# EAGLE design FresiaBoard (EAGLE 7.7.0)
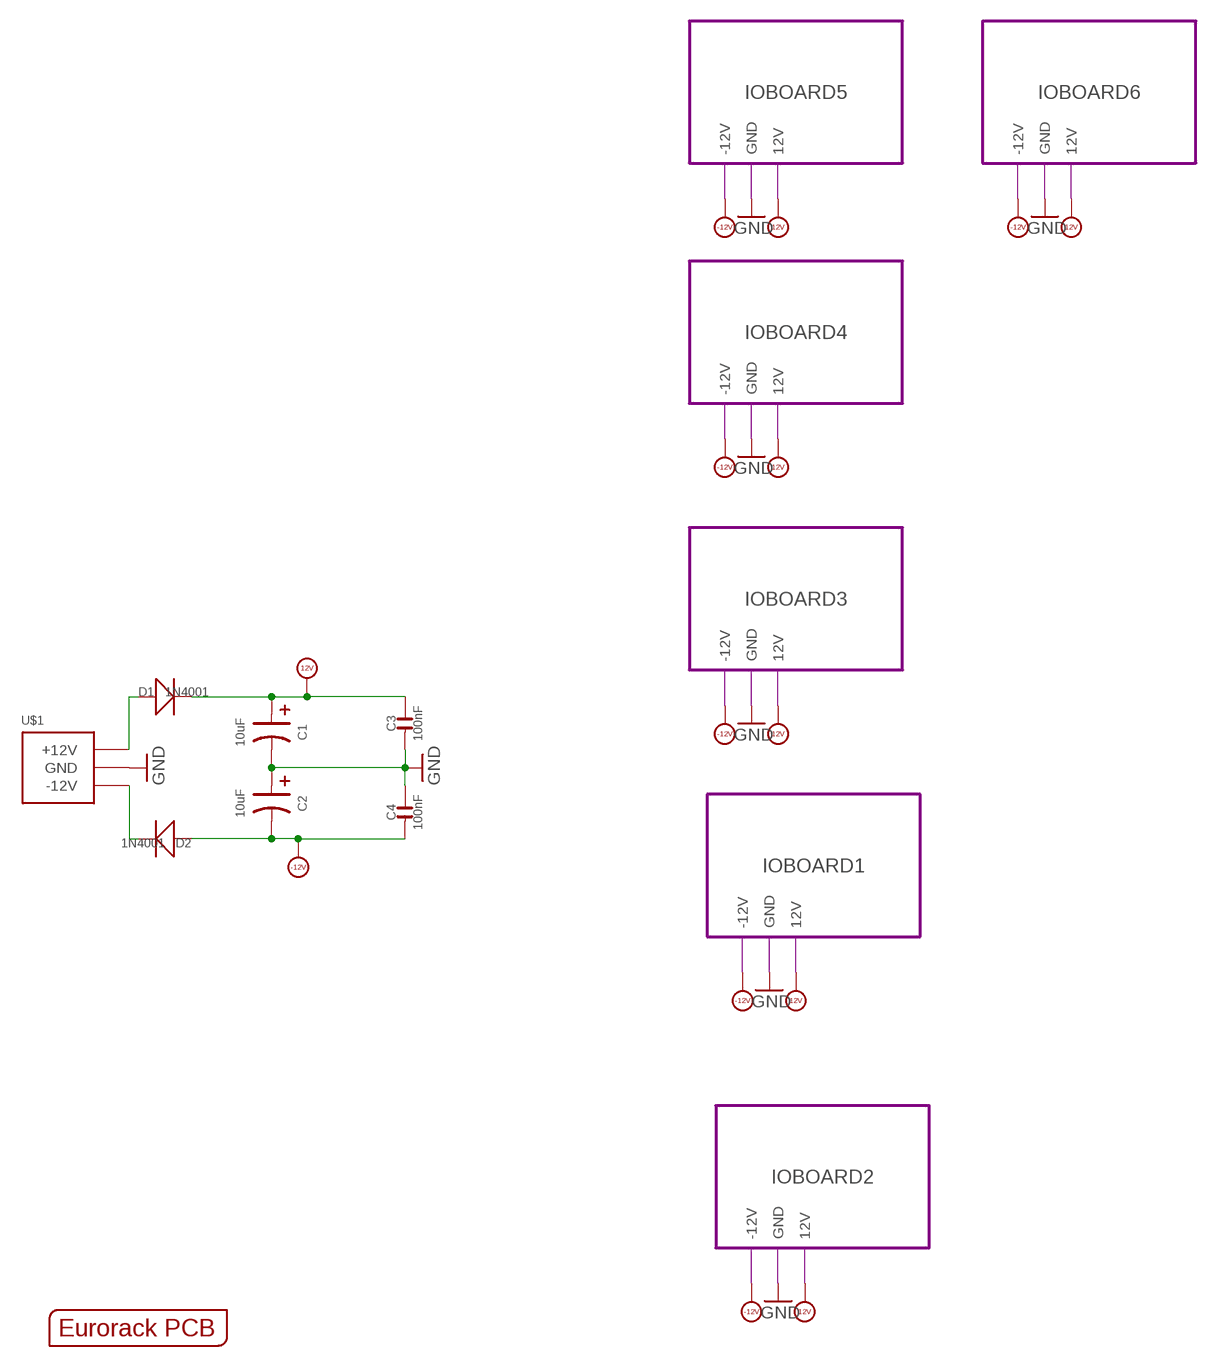
[diagram p0: schematic, sheet 1]

## Parts
C1  10uF  C-POLAR-A  [CASE-A_3216]
C2  10uF  C-POLAR-A  [CASE-A_3216]
C3  100nF  C-0603  [C0603]
C4  100nF  C-0603  [C0603]
D1  1N4001  D-SOD-123  [SOD123]
D2  1N4001  D-SOD-123  [SOD123]
PCB1  EURORACK_PCB6HP  [EURORACK6HPPCB]
U$1  POWER_SIMPLE10  [POWER_10]

## Module instances
IOBOARD1 = IOBOARD
IOBOARD2 = IOBOARD
IOBOARD3 = IOBOARD
IOBOARD4 = IOBOARD
IOBOARD5 = IOBOARD
IOBOARD6 = IOBOARD

## Nets
12V [POWER]: C1.+ C3.2 D1.- ; port IOBOARD1.12V IOBOARD2.12V IOBOARD3.12V IOBOARD4.12V IOBOARD5.12V IOBOARD6.12V
-12V [POWER]: C2.- C4.1 D2.+ ; port IOBOARD1.-12V IOBOARD2.-12V IOBOARD3.-12V IOBOARD4.-12V IOBOARD5.-12V IOBOARD6.-12V
GND: C1.- C2.+ C3.1 C4.2 U$1.3(GND) U$1.4(GND) U$1.5(GND) U$1.6(GND) U$1.7(GND) U$1.8(GND) ; port IOBOARD1.GND IOBOARD2.GND IOBOARD3.GND IOBOARD4.GND IOBOARD5.GND IOBOARD6.GND
N$1 [POWER]: D2.- U$1.1(-12V) U$1.2(-12V)
N$6 [POWER]: D1.+ U$1.9(+12V) U$1.10(+12V)

## Library data of the parts
C1 C2 = EurorackModularParts:C-POLAR*
C3 C4 = OPL:C*
D1 D2 = OPL:D*: DIODE
PCB1 = EurorackModularParts:EURORACK_PCB
U$1 = EurorackModularParts:POWER_SIMPLE

## Module IOBOARD
Ports: GND(io) -12V(io) 12V(io)
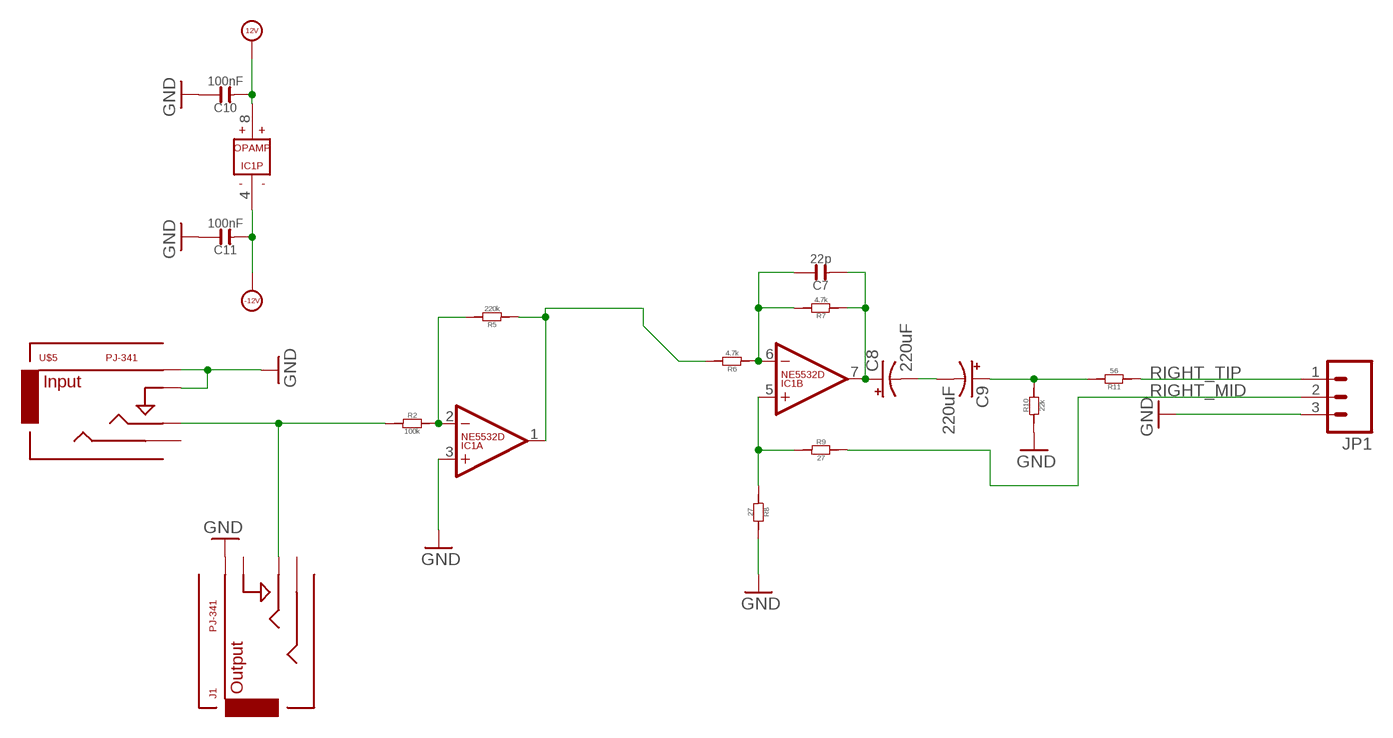
[diagram p1: schematic, module IOBOARD, sheet 1]

### Parts
C7  22p  C-0603  [C0603]
C8  220uF  CPOL-US153CLV-0505  [153CLV-0505]
C9  220uF  CPOL-US153CLV-0505  [153CLV-0505]
C10  100nF  C-0603  [C0603]
C11  100nF  C-0603  [C0603]
IC1  NE5532D  [SO08]
J1  PJ-341  AUDIO-JACKOUTPUT  [3.5MM-JACK-SWITCH-13MM-OUTPUT]
JP1  M03PTH  [1X03]
R2  100k  R-0603  [R0603]
R5  220k  R-0603  [R0603]
R6  4.7k  R-0603  [R0603]
R7  4.7k  R-0603  [R0603]
R8  27  R-0603  [R0603]
R9  27  R-0603  [R0603]
R10  22k  R-0603  [R0603]
R11  56  R-0603  [R0603]
U$5  PJ-341  AUDIO-JACKINPUT  [3.5MM-JACK-SWITCH-13MM-INPUT]

### Nets
12V [POWER]: C10.1 IC1.8(P:V+)
-12V [POWER]: C11.1 IC1.4(P:V-)
GND: C10.2 C11.2 IC1.3(A:+IN) J1.RING@3(RING) JP1.3 R8.2 R10.1 U$5.RING@3(RING) U$5.SWITCH@3(SWITCH)
N$2: C7.1 C8.+ IC1.7(B:OUT) R7.1
N$3: IC1.5(B:+IN) R8.1 R9.1
N$4: C7.2 IC1.6(B:-IN) R6.1 R7.2
N$5: IC1.2(A:-IN) R2.2 R5.2
N$6: IC1.1(A:OUT) R5.1 R6.2
N$7: J1.TIP@3(TIP) R2.1 U$5.TIP@3(TIP)
N$8: C8.- C9.-
N$9: C9.+ R10.2 R11.2
RIGHT_MID: JP1.2 R9.2
RIGHT_TIP: JP1.1 R11.1
Unconnected: J1.SECOND@3(SECOND) J1.SWITCH@3(SWITCH) U$5.SECOND@3(SECOND)

### Library data of the parts
C7 C10 C11 = OPL:C*
C8 C9 = adafruit:CPOL-US: POLARIZED CAPACITOR, American symbol
IC1 = EurorackModularParts:NE5532: AUDIO AMPLIFIER
J1 = EurorackModularParts:AUDIO-JACK: Switching Mono 3.5mm Audio Jack from Erthenvar.; DESC: Output; MPN: PJ-341
JP1 = SparkFun-Connectors:M03: Header 3 Standard 3-pin 0.1" header. Use with straight break away headers (SKU : PRT-00116), right angle break away headers (PRT-00553), swiss pins (PRT-00743), machine pins (PRT-00117), and female headers (PRT-00115). Molex polarized connector foot print use with SKU : PRT-08232 with associated crimp pins and housings.
R2 R5-R11 = OPL:R*
U$5 = EurorackModularParts:AUDIO-JACK: Switching Mono 3.5mm Audio Jack from Erthenvar.; DESC: Input; MPN: PJ-341

## Net classes
0 default: width 0.203 mm
1 POWER: width 0.305 mm

## Board
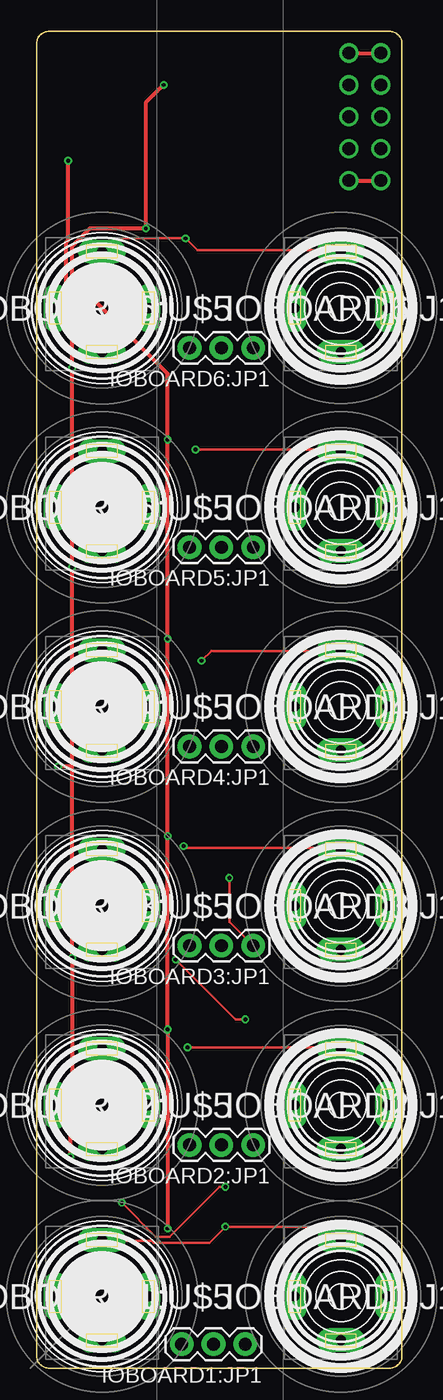
[diagram p2: board, top side]
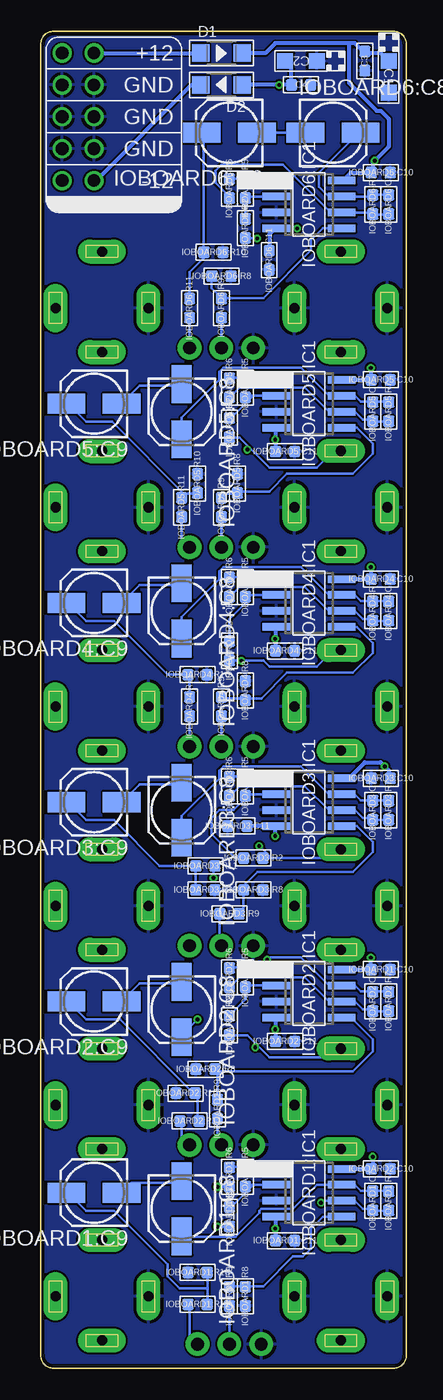
[diagram p3: board, bottom side, seen from below]

Size 29.14 x 106.5 mm. Coordinates in mm from the lower left corner, seen from the top.
Copper layers (1*16): Top 0.035mm / dielectric 1.5mm / Bottom 0.035mm
Design rules "ITEADstudio_DRC": minimum track width 6mil, minimum drill 12mil, track to track 6mil, track to pad 6mil, pad to pad 6mil, via to via 6mil, smd to smd 0mil, copper to edge 10mil, drill to drill 10mil, minimum pad ring 10mil, minimum via ring 6mil, stop-mask expansion 2mil, vias tented up to drill 100mil, thermal gap 10mil

### Footprints (pad centres in the part's own frame; a part is rotated, then mirrored left to right if it is on the bottom)
CASE-A_3216 = smd 1.27 x 1.27: + -1.27,0; - 1.27,0
C0603 = smd 0.889 x 0.889: 1 -0.762,0; 2 0.762,0
SOD123 = smd 1.397 x 1.397: + -1.651,0; - 1.651,0
153CLV-0505 = smd 3 x 1.6: + 2.2,0; - -2.2,0
SO08 = smd 0.6 x 2.2: 1 -1.905,-2.6; 2 -0.635,-2.6; 3 0.635,-2.6; 4 1.905,-2.6; 5 1.905,2.6; 6 0.635,2.6; 7 -0.635,2.6; 8 -1.905,2.6
3.5MM-JACK-SWITCH-13MM-OUTPUT = drill 0.8 pad 1.93 long: RING@3 -3.7,0; SECOND@3 0,-3.5; SWITCH@3 3.7,0; TIP@3 0,4.5
1X03 = drill 1.016 pad 1.88: 1 0,0; 2 2.54,0; 3 5.08,0
R0603 = smd 0.889 x 0.889: 1 -0.762,0; 2 0.762,0
3.5MM-JACK-SWITCH-13MM-INPUT = drill 0.8 pad 1.93 long: RING@3 -3.7,0; SECOND@3 0,-3.5; SWITCH@3 3.7,0; TIP@3 0,4.5
POWER_10 = drill 1.016: 1 -5.08,-1.27; 2 -5.08,1.27; 3 -2.54,-1.27; 4 -2.54,1.27; 5 0,-1.27; 6 0,1.27; 7 2.54,-1.27; 8 2.54,1.27; 9 5.08,-1.27; 10 5.08,1.27

### Placement (x,y rotation side)
C1  1.41,102.87 270 bottom
C2  8.39,104.14 180 bottom
C3  3.31,104.14 90 bottom
C4  8.39,102.23 0 bottom
D1  14.74,104.77 0 bottom
D2  14.74,102.23 180 bottom
IOBOARD1:C7  22p  [C0603]  2.67,13.34 270 bottom
IOBOARD1:C8  220uF  [153CLV-0505]  17.91,12.7 270 bottom
IOBOARD1:C9  220uF  [153CLV-0505]  24.9,13.97 180 bottom
IOBOARD1:C10  100nF  [C0603]  2.04,31.75 0 bottom
IOBOARD1:C11  100nF  [C0603]  9.66,10.16 0 bottom
IOBOARD1:IC1  NE5532D  [SO08]  7.76,13.97 270 bottom
IOBOARD1:J1  PJ-341  [3.5MM-JACK-SWITCH-13MM-OUTPUT]  24.27,5.71 0 top
IOBOARD1:JP1  [1X03]  16.64,1.91 180 top
IOBOARD1:R2  100k  [R0603]  14.11,12.07 90 bottom
IOBOARD1:R5  220k  [R0603]  12.84,15.24 270 bottom
IOBOARD1:R6  4.7k  [R0603]  14.11,15.24 90 bottom
IOBOARD1:R7  4.7k  [R0603]  1.41,13.34 270 bottom
IOBOARD1:R8  27  [R0603]  12.84,5.71 270 bottom
IOBOARD1:R9  27  [R0603]  14.11,5.71 270 bottom
IOBOARD1:R10  22k  [R0603]  16.64,7.62 0 bottom
IOBOARD1:R11  56  [R0603]  16.64,5.08 0 bottom
IOBOARD1:U$5  PJ-341  [3.5MM-JACK-SWITCH-13MM-INPUT]  5.21,5.71 0 top
IOBOARD2:C7  22p  [C0603]  2.67,29.21 270 bottom
IOBOARD2:C8  220uF  [153CLV-0505]  17.91,28.57 270 bottom
IOBOARD2:C9  220uF  [153CLV-0505]  24.9,29.21 180 bottom
IOBOARD2:C10  100nF  [C0603]  2.04,15.88 0 bottom
IOBOARD2:C11  100nF  [C0603]  9.66,26.04 0 bottom
IOBOARD2:IC1  NE5532D  [SO08]  7.76,29.85 270 bottom
IOBOARD2:J1  PJ-341  [3.5MM-JACK-SWITCH-13MM-OUTPUT]  24.27,20.96 0 top
IOBOARD2:JP1  [1X03]  17.28,17.78 180 top
IOBOARD2:R2  100k  [R0603]  14.11,27.3 90 bottom
IOBOARD2:R5  220k  [R0603]  12.84,31.11 270 bottom
IOBOARD2:R6  4.7k  [R0603]  14.11,31.11 90 bottom
IOBOARD2:R7  4.7k  [R0603]  1.41,29.21 270 bottom
IOBOARD2:R8  27  [R0603]  16.01,23.81 180 bottom
IOBOARD2:R9  27  [R0603]  15.06,20.64 270 bottom
IOBOARD2:R10  22k  [R0603]  17.6,21.91 0 bottom
IOBOARD2:R11  56  [R0603]  17.28,19.68 0 bottom
IOBOARD2:U$5  PJ-341  [3.5MM-JACK-SWITCH-13MM-INPUT]  5.21,20.96 0 top
IOBOARD3:C7  22p  [C0603]  2.67,44.45 270 bottom
IOBOARD3:C8  220uF  [153CLV-0505]  17.91,44.45 270 bottom
IOBOARD3:C9  220uF  [153CLV-0505]  24.9,45.08 180 bottom
IOBOARD3:C10  100nF  [C0603]  2.04,46.99 180 bottom
IOBOARD3:C11  100nF  [C0603]  13.47,43.18 180 bottom
IOBOARD3:IC1  NE5532D  [SO08]  7.76,45.08 270 bottom
IOBOARD3:J1  PJ-341  [3.5MM-JACK-SWITCH-13MM-OUTPUT]  24.27,36.83 0 top
IOBOARD3:JP1  [1X03]  17.28,33.66 180 top
IOBOARD3:R2  100k  [R0603]  12.2,40.64 180 bottom
IOBOARD3:R5  220k  [R0603]  12.84,46.36 270 bottom
IOBOARD3:R6  4.7k  [R0603]  14.11,46.36 90 bottom
IOBOARD3:R7  4.7k  [R0603]  1.41,44.45 270 bottom
IOBOARD3:R8  27  [R0603]  12.2,38.1 0 bottom
IOBOARD3:R9  27  [R0603]  14.11,36.19 180 bottom
IOBOARD3:R10  22k  [R0603]  16.01,38.1 180 bottom
IOBOARD3:R11  56  [R0603]  16.01,40 180 bottom
IOBOARD3:U$5  PJ-341  [3.5MM-JACK-SWITCH-13MM-INPUT]  5.21,36.83 0 top
IOBOARD4:C7  22p  [C0603]  1.41,60.33 270 bottom
IOBOARD4:C8  220uF  [153CLV-0505]  17.91,60.33 270 bottom
IOBOARD4:C9  220uF  [153CLV-0505]  24.9,60.96 180 bottom
IOBOARD4:C10  100nF  [C0603]  2.04,62.86 0 bottom
IOBOARD4:C11  100nF  [C0603]  9.66,57.15 0 bottom
IOBOARD4:IC1  NE5532D  [SO08]  7.76,60.96 270 bottom
IOBOARD4:J1  PJ-341  [3.5MM-JACK-SWITCH-13MM-OUTPUT]  24.27,52.7 0 top
IOBOARD4:JP1  [1X03]  17.28,49.53 180 top
IOBOARD4:R2  100k  [R0603]  14.11,57.15 90 bottom
IOBOARD4:R5  220k  [R0603]  12.84,62.23 270 bottom
IOBOARD4:R6  4.7k  [R0603]  14.11,62.23 90 bottom
IOBOARD4:R7  4.7k  [R0603]  2.67,60.33 270 bottom
IOBOARD4:R8  27  [R0603]  12.84,53.97 90 bottom
IOBOARD4:R9  27  [R0603]  14.74,52.7 270 bottom
IOBOARD4:R10  22k  [R0603]  16.64,55.24 180 bottom
IOBOARD4:R11  56  [R0603]  17.28,52.7 90 bottom
IOBOARD4:U$5  PJ-341  [3.5MM-JACK-SWITCH-13MM-INPUT]  5.21,52.7 0 top
IOBOARD5:C7  22p  [C0603]  2.67,76.2 270 bottom
IOBOARD5:C8  220uF  [153CLV-0505]  17.91,76.2 270 bottom
IOBOARD5:C9  220uF  [153CLV-0505]  24.9,76.83 180 bottom
IOBOARD5:C10  100nF  [C0603]  2.04,78.74 0 bottom
IOBOARD5:C11  100nF  [C0603]  9.66,73.02 0 bottom
IOBOARD5:IC1  NE5532D  [SO08]  7.76,76.83 270 bottom
IOBOARD5:J1  PJ-341  [3.5MM-JACK-SWITCH-13MM-OUTPUT]  24.27,68.58 0 top
IOBOARD5:JP1  [1X03]  17.28,65.41 180 top
IOBOARD5:R2  100k  [R0603]  14.11,74.93 90 bottom
IOBOARD5:R5  220k  [R0603]  12.84,78.1 270 bottom
IOBOARD5:R6  4.7k  [R0603]  14.11,78.1 90 bottom
IOBOARD5:R7  4.7k  [R0603]  1.41,76.2 270 bottom
IOBOARD5:R8  27  [R0603]  13.47,70.48 90 bottom
IOBOARD5:R9  27  [R0603]  14.74,68.58 270 bottom
IOBOARD5:R10  22k  [R0603]  16.64,70.48 270 bottom
IOBOARD5:R11  56  [R0603]  17.91,68.58 90 bottom
IOBOARD5:U$5  PJ-341  [3.5MM-JACK-SWITCH-13MM-INPUT]  5.21,68.58 0 top
IOBOARD6:C7  22p  [C0603]  1.41,92.71 270 bottom
IOBOARD6:C8  220uF  [153CLV-0505]  5.85,98.42 0 bottom
IOBOARD6:C9  220uF  [153CLV-0505]  14.11,98.42 180 bottom
IOBOARD6:C10  100nF  [C0603]  2.04,95.25 0 bottom
IOBOARD6:C11  100nF  [C0603]  10.93,88.27 270 bottom
IOBOARD6:IC1  NE5532D  [SO08]  7.76,92.71 270 bottom
IOBOARD6:J1  PJ-341  [3.5MM-JACK-SWITCH-13MM-OUTPUT]  24.27,84.45 0 top
IOBOARD6:JP1  [1X03]  17.28,81.28 180 top
IOBOARD6:R2  100k  [R0603]  12.84,90.8 90 bottom
IOBOARD6:R5  220k  [R0603]  12.84,93.98 270 bottom
IOBOARD6:R6  4.7k  [R0603]  14.11,93.98 90 bottom
IOBOARD6:R7  4.7k  [R0603]  2.67,92.71 270 bottom
IOBOARD6:R8  27  [R0603]  14.74,86.99 0 bottom
IOBOARD6:R9  27  [R0603]  14.74,84.45 270 bottom
IOBOARD6:R10  22k  [R0603]  15.38,88.9 180 bottom
IOBOARD6:R11  56  [R0603]  17.28,84.45 90 bottom
IOBOARD6:U$5  PJ-341  [3.5MM-JACK-SWITCH-13MM-INPUT]  5.21,84.45 0 top
PCB1  -0.5,0 0 top
U$1  26.17,99.69 90 bottom

### Tracks (layer width: path | path; a pad name or v marks a point on that pad's centre or on a via)
12V  (via drill 0.3)
  Top 0.305: v2.67,16.83 2.67,19.21 2.83,19.37 v2.83,32.7 2.83,47.94 | 2.83,47.94 v2.83,63.82 v2.83,79.69 2.83,86.04 2.36,86.52 2.36,89.69 2.52,89.85 v2.52,96.2 | 2.83,47.94 v1.72,47.94
  Bottom 0.305: IOBOARD6:IC1.8 5.06,94.61 4.42,95.25 IOBOARD6:C10.1 2.67,95.25 2.67,96.04 v2.52,96.2 1.41,97.31 1.41,99.54 2.04,100.17 2.36,100.17 4.58,102.39 4.58,105.57 | 3.31,104.77 2.04,104.77 C1.+ | D1.- 11.25,104.77 10.45,105.57 4.58,105.57 | 4.58,105.57 4.1,105.57 3.31,104.77 | 3.31,104.77 C3.2 | IOBOARD3:IC1.8 4.58,46.99 3.31,48.26 2.04,48.26 v1.72,47.94 1.41,47.62 1.41,46.99 IOBOARD3:C10.1 | IOBOARD5:IC1.8 2.83,78.74 | IOBOARD4:IC1.8 2.83,62.86 | IOBOARD1:IC1.8 IOBOARD2:C10.1 2.67,15.88 v2.67,16.83 | IOBOARD2:IC1.8 2.83,31.75 | 2.83,31.75 v2.83,32.7 | 2.83,31.75 IOBOARD1:C10.1 | v2.83,63.82 2.83,62.86 | 2.83,62.86 IOBOARD4:C10.1 | v2.83,79.69 2.83,78.74 | 2.83,78.74 IOBOARD5:C10.1
-12V  (via drill 0.3)
  Top 0.305: v10.14,102.23 8.71,100.81 v8.71,90.8 4.26,90.8 2.83,89.38 2.83,86.84 10.45,79.22 v10.45,73.98 v10.45,58.1 v10.45,42.39 v10.45,26.99 v10.45,11.11
  Bottom 0.305: IOBOARD6:C11.1 10.93,90.33 10.45,90.8 IOBOARD6:IC1.4 v8.71,90.8 | 9.18,102.23 9.18,103.66 C2.- | 9.18,102.23 v10.14,102.23 D2.+ | 9.18,102.23 C4.1 | 10.45,43.18 IOBOARD3:C11.1 | IOBOARD5:C11.1 10.45,73.02 v10.45,73.98 10.45,74.93 IOBOARD5:IC1.4 | IOBOARD4:C11.1 10.45,57.15 v10.45,58.1 10.45,59.05 IOBOARD4:IC1.4 | IOBOARD1:C11.1 10.45,10.16 v10.45,11.11 10.45,12.07 IOBOARD1:IC1.4 | IOBOARD2:C11.1 10.45,26.04 v10.45,26.99 10.45,27.94 IOBOARD2:IC1.4 | v10.45,42.39 10.45,43.18 | 10.45,43.18 IOBOARD3:IC1.4
GND
  pour Bottom: -1.64,107.57 -1.01,-2.71 30.11,-2.71 30.49,107.57
IOBOARD1:N$2
  Bottom 0.203: 2.67,14.13 1.41,14.13 IOBOARD1:R7.1 | 2.67,14.13 3.63,14.13 4.1,14.61 IOBOARD1:IC1.7 7.12,14.61 9.03,12.7 11.56,12.7 11.72,12.54 11.72,12.38 13.63,10.48 17.91,10.48 IOBOARD1:C8.+ | 2.67,14.13 IOBOARD1:C7.1
IOBOARD1:N$3
  Bottom 0.203: 12.84,6.51 14.11,6.51 IOBOARD1:R9.1 | 12.84,6.51 11.41,6.51 9.03,8.89 8.23,8.89 7.6,9.52 7.6,11.11 6.64,12.07 IOBOARD1:IC1.5 | 12.84,6.51 IOBOARD1:R8.1
IOBOARD1:N$4  (via drill 0.3)
  Top 0.203: v15.06,14.45 14.58,14.45 10.61,10.48 9.5,10.48 v6.8,13.18
  Bottom 0.203: IOBOARD1:R7.2 1.41,12.54 2.67,12.54 IOBOARD1:C7.2 2.67,12.7 3.47,12.7 4.1,13.34 IOBOARD1:IC1.6 6.64,13.34 v6.8,13.18 | v15.06,14.45 14.11,14.45 IOBOARD1:R6.1
IOBOARD1:N$5
  Bottom 0.203: IOBOARD1:IC1.2 12.2,14.61 | 12.2,14.61 12.84,14.61 IOBOARD1:R5.2 | 12.2,14.61 13.95,12.86 14.11,12.86 IOBOARD1:R2.2
IOBOARD1:N$6
  Bottom 0.203: IOBOARD1:R6.2 14.11,16.03 12.84,16.03 IOBOARD1:R5.1 12.84,15.88 IOBOARD1:IC1.1
IOBOARD1:N$7  (via drill 0.3)
  Top 0.203: IOBOARD1:J1.TIP@3 24.27,10.32 23.31,11.27 v15.06,11.27 13.79,10 9.34,10 9.18,10.16 5.21,10.16 IOBOARD1:U$5.TIP@3
  Bottom 0.203: v15.06,11.27 14.11,11.27 IOBOARD1:R2.1
IOBOARD1:N$8
  Bottom 0.203: IOBOARD1:C8.- 17.91,14.76 21.88,14.76 22.68,13.97 IOBOARD1:C9.-
IOBOARD1:N$9
  Bottom 0.203: 15.85,6.35 15.85,7.62 IOBOARD1:R10.2 | 15.85,6.35 15.85,5.08 IOBOARD1:R11.2 | 15.85,6.35 18.07,6.35 19.03,7.3 19.03,8.25 23.31,12.54 25.54,12.54 26.96,13.97 IOBOARD1:C9.+
IOBOARD1:RIGHT_MID
  Bottom 0.203: IOBOARD1:JP1.2 IOBOARD1:R9.2
IOBOARD1:RIGHT_TIP
  Bottom 0.203: IOBOARD1:JP1.1 17.28,2.54 17.28,5.08 IOBOARD1:R11.1
IOBOARD2:N$2  (via drill 0.3)
  Top 0.203: v16.64,27.78 15.85,27.78 v11.09,32.54
  Bottom 0.203: 2.67,30 1.41,30 IOBOARD2:R7.1 | 2.67,30 3.63,30 4.1,30.48 IOBOARD2:IC1.7 6.17,30.48 8.39,32.7 10.93,32.7 v11.09,32.54 | 2.67,30 IOBOARD2:C7.1 | v16.64,27.78 17.91,26.51 IOBOARD2:C8.+
IOBOARD2:N$3
  Bottom 0.203: 15.06,23.65 IOBOARD2:R9.1 | 15.06,23.65 15.22,23.81 IOBOARD2:R8.1 15.06,23.65 | 15.06,23.65 4.26,23.65 2.67,25.24 2.67,26.19 4.42,27.94 IOBOARD2:IC1.5
IOBOARD2:N$4
  Bottom 0.203: IOBOARD2:R7.2 1.41,28.42 2.67,28.42 IOBOARD2:C7.2 2.67,28.57 3.47,28.57 4.1,29.21 IOBOARD2:IC1.6 6.17,29.21 8.07,31.11 13.31,31.11 13.95,30.48 14.11,30.48 IOBOARD2:R6.1
IOBOARD2:N$5
  Bottom 0.203: IOBOARD2:IC1.2 12.84,30.48 IOBOARD2:R5.2 12.84,29.37 14.11,28.1 IOBOARD2:R2.2
IOBOARD2:N$6
  Bottom 0.203: IOBOARD2:R6.2 14.11,31.91 12.84,31.91 IOBOARD2:R5.1 12.84,31.75 IOBOARD2:IC1.1
IOBOARD2:N$7  (via drill 0.3)
  Top 0.203: v12.04,25.56 24.27,25.56 IOBOARD2:J1.TIP@3
  Bottom 0.203: 11.88,25.72 10.93,24.76 5.85,24.76 5.21,25.4 IOBOARD2:U$5.TIP@3 | 11.88,25.72 12.68,26.51 14.11,26.51 IOBOARD2:R2.1 | 11.88,25.72 v12.04,25.56
IOBOARD2:N$8
  Bottom 0.203: IOBOARD2:C8.- 17.91,30.64 21.25,30.64 22.68,29.21 IOBOARD2:C9.-
IOBOARD2:N$9
  Bottom 0.203: IOBOARD2:R11.2 16.64,19.68 16.64,21.75 16.8,21.91 IOBOARD2:R10.2 16.96,21.91 22.84,27.78 25.54,27.78 26.96,29.21 IOBOARD2:C9.+
IOBOARD2:RIGHT_MID
  Bottom 0.203: IOBOARD2:R9.2 15.06,18.1 IOBOARD2:JP1.2
IOBOARD2:RIGHT_TIP
  Bottom 0.203: IOBOARD2:JP1.1 17.91,18.42 17.91,19.68 IOBOARD2:R11.1
IOBOARD3:N$2
  Bottom 0.203: 2.67,45.24 1.41,45.24 IOBOARD3:R7.1 | 2.67,45.24 3.63,45.24 4.1,45.72 IOBOARD3:IC1.7 6.17,45.72 8.39,47.94 14.58,47.94 14.9,47.62 14.9,46.99 17.91,43.97 IOBOARD3:C8.+ | 2.67,45.24 IOBOARD3:C7.1
IOBOARD3:N$3
  Bottom 0.203: IOBOARD3:R9.1 13.47,36.19 12.99,36.67 12.99,38.1 IOBOARD3:R8.1 12.84,38.1 12.84,38.58 11.88,39.53 4.26,39.53 2.67,41.12 2.67,41.91 3.95,43.18 IOBOARD3:IC1.5
IOBOARD3:N$4
  Bottom 0.203: IOBOARD3:R7.2 1.41,43.66 2.67,43.66 IOBOARD3:C7.2 2.67,43.81 3.47,43.81 4.1,44.45 IOBOARD3:IC1.6 6.17,44.45 8.07,46.36 13.31,46.36 13.95,45.72 14.11,45.72 IOBOARD3:R6.1
IOBOARD3:N$5
  Bottom 0.203: IOBOARD3:R2.2 13.63,40.64 15.53,42.55 15.53,43.81 14.9,44.45 13.79,44.45 12.84,45.4 IOBOARD3:R5.2 12.84,45.72 IOBOARD3:IC1.2
IOBOARD3:N$6
  Bottom 0.203: IOBOARD3:R6.2 14.11,47.15 12.84,47.15 IOBOARD3:R5.1 12.84,46.99 IOBOARD3:IC1.1
IOBOARD3:N$7  (via drill 0.3)
  Top 0.203: v11.72,41.59 11.88,41.43 24.27,41.43 IOBOARD3:J1.TIP@3
  Bottom 0.203: 10.77,40.64 5.85,40.64 5.21,41.28 IOBOARD3:U$5.TIP@3 | 10.77,40.64 IOBOARD3:R2.1 | 10.77,40.64 v11.72,41.59
IOBOARD3:N$8
  Bottom 0.203: IOBOARD3:C8.- 17.91,46.51 21.25,46.51 22.68,45.08 IOBOARD3:C9.-
IOBOARD3:N$9
  Bottom 0.203: 16.8,40 16.8,38.1 IOBOARD3:R10.2 | 16.8,40 19.66,40 23.31,43.66 25.54,43.66 26.96,45.08 IOBOARD3:C9.+ | 16.8,40 IOBOARD3:R11.2
IOBOARD3:RIGHT_MID
  Bottom 0.203: IOBOARD3:JP1.2 14.9,33.81 14.9,36.19 IOBOARD3:R9.2
IOBOARD3:RIGHT_TIP  (via drill 0.3)
  Top 0.203: v15.38,39.05 15.38,35.56 IOBOARD3:JP1.1
  Bottom 0.203: v15.38,39.05 15.38,40 IOBOARD3:R11.1
IOBOARD4:N$2
  Bottom 0.203: 2.67,61.12 1.41,61.12 IOBOARD4:C7.1 | 2.67,61.12 3.63,61.12 4.1,61.59 IOBOARD4:IC1.7 6.17,61.59 8.39,63.82 14.58,63.82 14.9,63.5 14.9,62.86 17.91,59.85 IOBOARD4:C8.+ | 2.67,61.12 IOBOARD4:R7.1
IOBOARD4:N$3
  Bottom 0.203: 12.84,53.34 14.74,53.34 IOBOARD4:R9.1 | 12.84,53.34 11.56,53.34 9.5,55.4 4.26,55.4 2.67,56.99 2.67,57.78 3.95,59.05 IOBOARD4:IC1.5 | 12.84,53.34 IOBOARD4:R8.1
IOBOARD4:N$4
  Bottom 0.203: IOBOARD4:C7.2 1.41,59.53 2.67,59.53 IOBOARD4:R7.2 2.67,59.69 3.47,59.69 4.1,60.33 IOBOARD4:IC1.6 6.17,60.33 8.07,62.23 13.31,62.23 13.95,61.59 14.11,61.59 IOBOARD4:R6.1
IOBOARD4:N$5
  Bottom 0.203: IOBOARD4:R2.2 14.11,59.69 12.84,60.96 IOBOARD4:R5.2 12.84,61.59 IOBOARD4:IC1.2
IOBOARD4:N$6
  Bottom 0.203: IOBOARD4:R6.2 14.11,63.02 12.84,63.02 IOBOARD4:R5.1 12.84,62.86 IOBOARD4:IC1.1
IOBOARD4:N$7  (via drill 0.3)
  Top 0.203: v13.15,56.36 13.95,57.15 24.27,57.15 IOBOARD4:J1.TIP@3
  Bottom 0.203: IOBOARD4:R2.1 14.11,56.36 v13.15,56.36 11.41,56.36 10.93,55.88 7.12,55.88 5.85,57.15 5.21,57.15 IOBOARD4:U$5.TIP@3
IOBOARD4:N$8
  Bottom 0.203: IOBOARD4:C8.- 17.91,62.39 21.25,62.39 22.68,60.96 IOBOARD4:C9.-
IOBOARD4:N$9
  Bottom 0.203: IOBOARD4:R11.2 17.28,55.24 IOBOARD4:R10.2 19.03,55.24 23.31,59.53 25.54,59.53 26.96,60.96 IOBOARD4:C9.+
IOBOARD4:RIGHT_MID
  Bottom 0.203: IOBOARD4:JP1.2 IOBOARD4:R9.2
IOBOARD4:RIGHT_TIP
  Bottom 0.203: IOBOARD4:JP1.1 IOBOARD4:R11.1
IOBOARD5:N$2
  Bottom 0.203: 2.67,76.99 1.41,76.99 IOBOARD5:R7.1 | 2.67,76.99 3.63,76.99 4.1,77.47 IOBOARD5:IC1.7 6.17,77.47 8.39,79.69 14.58,79.69 14.9,79.38 14.9,78.74 17.91,75.72 IOBOARD5:C8.+ | 2.67,76.99 IOBOARD5:C7.1
IOBOARD5:N$3
  Bottom 0.203: IOBOARD5:R9.1 14.74,69.21 14.26,69.69 13.47,69.69 IOBOARD5:R8.1 13.47,69.85 10.93,69.85 9.5,71.28 4.26,71.28 2.67,72.87 2.67,73.66 3.95,74.93 IOBOARD5:IC1.5
IOBOARD5:N$4
  Bottom 0.203: IOBOARD5:R7.2 1.41,75.41 2.67,75.41 IOBOARD5:C7.2 2.67,75.56 3.47,75.56 4.1,76.2 IOBOARD5:IC1.6 6.17,76.2 8.07,78.1 13.31,78.1 13.95,77.47 14.11,77.47 IOBOARD5:R6.1
IOBOARD5:N$5
  Bottom 0.203: IOBOARD5:IC1.2 12.2,77.47 | 12.2,77.47 12.84,77.47 IOBOARD5:R5.2 | 12.2,77.47 13.95,75.72 14.11,75.72 IOBOARD5:R2.2
IOBOARD5:N$6
  Bottom 0.203: IOBOARD5:R6.2 14.11,78.9 12.84,78.9 IOBOARD5:R5.1 12.84,78.74 IOBOARD5:IC1.1
IOBOARD5:N$7  (via drill 0.3)
  Top 0.203: v12.68,73.18 24.27,73.18 IOBOARD5:J1.TIP@3
  Bottom 0.203: 12.52,73.34 10.93,71.75 7.12,71.75 5.85,73.02 5.21,73.02 IOBOARD5:U$5.TIP@3 | 12.52,73.34 13.31,74.14 14.11,74.14 IOBOARD5:R2.1 | 12.52,73.34 v12.68,73.18
IOBOARD5:N$8
  Bottom 0.203: IOBOARD5:C8.- 17.91,78.26 21.25,78.26 22.68,76.83 IOBOARD5:C9.-
IOBOARD5:N$9
  Bottom 0.203: 17.6,69.53 17.91,69.21 IOBOARD5:R11.2 17.6,69.53 | 17.6,69.53 17.44,69.69 16.64,69.69 IOBOARD5:R10.2 | 17.6,69.53 23.47,75.41 25.54,75.41 26.96,76.83 IOBOARD5:C9.+
IOBOARD5:RIGHT_MID
  Bottom 0.203: IOBOARD5:JP1.2 IOBOARD5:R9.2
IOBOARD5:RIGHT_TIP
  Bottom 0.203: IOBOARD5:R11.1 17.91,66.04 IOBOARD5:JP1.1
IOBOARD6:N$2
  Bottom 0.203: IOBOARD6:C7.1 1.41,93.5 2.67,93.5 IOBOARD6:R7.1 2.67,93.34 IOBOARD6:IC1.7 6.17,93.34 6.96,94.14 6.96,95.25 3.79,98.42 IOBOARD6:C8.+
IOBOARD6:N$3
  Bottom 0.203: 14.74,85.25 15.53,86.04 15.53,86.99 IOBOARD6:R8.1 | 14.74,85.25 11.41,85.25 7.6,89.06 7.6,89.85 6.64,90.8 IOBOARD6:IC1.5 | 14.74,85.25 IOBOARD6:R9.1
IOBOARD6:N$4
  Bottom 0.203: IOBOARD6:C7.2 1.41,91.92 2.67,91.92 IOBOARD6:R7.2 2.67,92.08 IOBOARD6:IC1.6 6.01,92.08 9.82,95.88 14.74,95.88 15.22,95.41 15.22,94.46 14.11,93.34 IOBOARD6:R6.1
IOBOARD6:N$5
  Bottom 0.203: IOBOARD6:R2.2 IOBOARD6:R5.2 12.84,93.34 IOBOARD6:IC1.2
IOBOARD6:N$6
  Bottom 0.203: IOBOARD6:R6.2 14.11,94.77 12.84,94.77 IOBOARD6:R5.1 12.84,94.61 IOBOARD6:IC1.1
IOBOARD6:N$7  (via drill 0.3)
  Top 0.203: IOBOARD6:U$5.TIP@3 5.21,89.06 6.17,90.01 v11.88,90.01 12.84,89.06 24.27,89.06 IOBOARD6:J1.TIP@3
  Bottom 0.203: v11.88,90.01 12.84,90.01 IOBOARD6:R2.1
IOBOARD6:N$8
  Bottom 0.203: IOBOARD6:C9.- IOBOARD6:C8.-
IOBOARD6:N$9
  Bottom 0.203: IOBOARD6:R11.2 17.28,87.31 16.17,88.42 16.17,88.9 | 16.17,88.9 16.17,98.42 IOBOARD6:C9.+ | 16.17,88.9 IOBOARD6:R10.2
IOBOARD6:RIGHT_MID
  Bottom 0.203: IOBOARD6:JP1.2 IOBOARD6:R9.2
IOBOARD6:RIGHT_TIP
  Bottom 0.203: IOBOARD6:JP1.1 IOBOARD6:R11.1
N$1
  Top 0.305: U$1.1 U$1.2
  Bottom 0.305: D2.- 17.12,102.23 24.74,94.61 U$1.1
N$6
  Top 0.305: U$1.9 U$1.10
  Bottom 0.305: U$1.9 D1.+